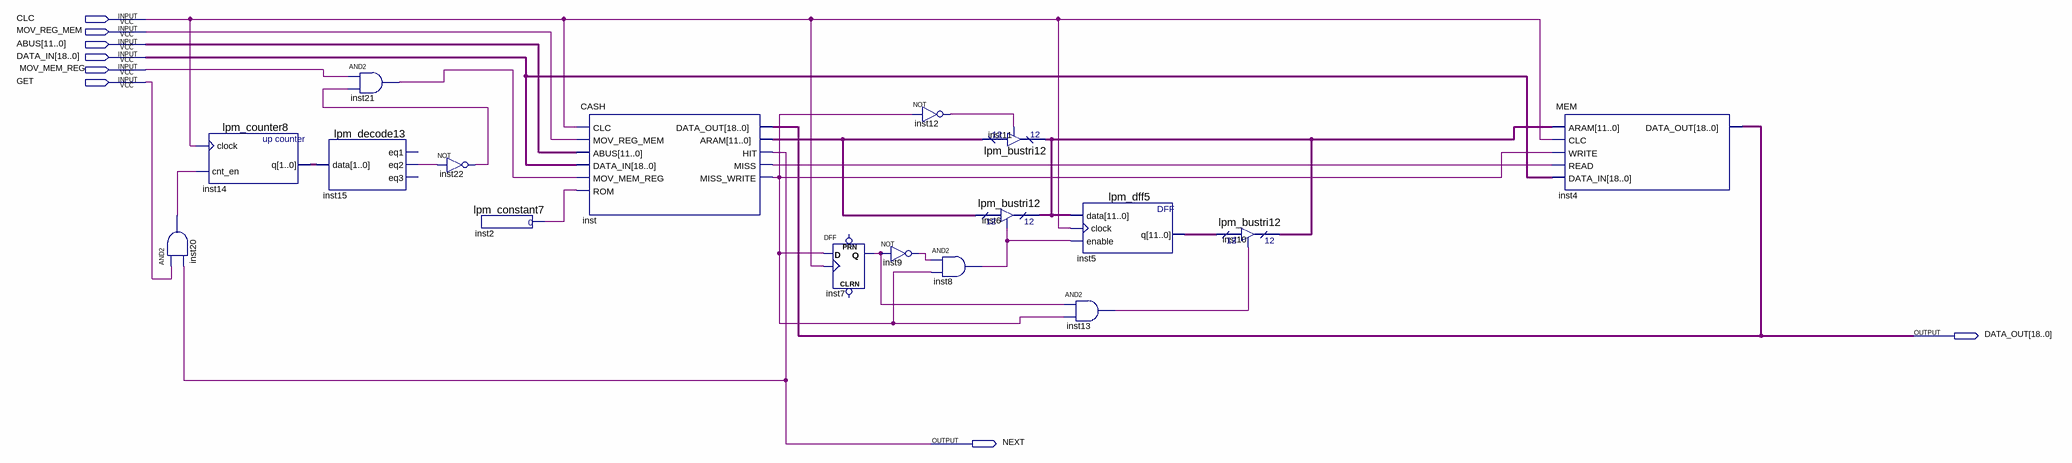
[diagram p0: schematic sheet]
// Quartus schematic MEMORY.bdf as structural Verilog: 17 symbols, 8 pins
module MEMORY (
  input  CLC,
  input  MOV_REG_MEM,
  input  [11:0] ABUS,
  input  [18:0] DATA_IN,
  input  MOV_MEM_REG,
  input  GET,
  output [18:0] DATA_OUT,
  output NEXT
);

  wire inst2_result, inst7_q, inst8_out, inst9_out, inst12_out, inst13_out, inst15_eq2, inst20_out,
       inst21_out, inst22_out, inst_miss, inst_miss_write;
  wire [1:0] inst14_q;
  wire [11:0] inst5_q, inst11_tridata, inst_aram;

  and inst20 (inst20_out, GET, NEXT);
  lpm_counter8 inst14 (.clock(CLC), .cnt_en(inst20_out), .q(inst14_q));
  lpm_decode13 inst15 (.data(inst14_q), .eq2(inst15_eq2));  // open: eq1, eq3
  and inst21 (inst21_out, MOV_MEM_REG, inst22_out);
  not inst22 (inst22_out, inst15_eq2);
  lpm_constant7 inst2 (.result(inst2_result));
  CASH inst (
    .CLC(CLC), .MOV_REG_MEM(MOV_REG_MEM), .ABUS(ABUS), .DATA_IN(DATA_IN), .MOV_MEM_REG(inst21_out),
    .ROM(inst2_result), .DATA_OUT(DATA_OUT), .ARAM(inst_aram), .HIT(NEXT), .MISS(inst_miss),
    .MISS_WRITE(inst_miss_write));
  DFF inst7 (.CLK(CLC), .D(inst_miss_write), .Q(inst7_q));  // open: CLRN, PRN
  not inst9 (inst9_out, inst7_q);
  not inst12 (inst12_out, inst_miss_write);
  and inst8 (inst8_out, inst9_out, inst_miss_write);
  lpm_bustri12 inst11 (.enabledt(inst12_out), .data(inst_aram), .tridata(inst11_tridata));
  lpm_bustri12 inst6 (.enabledt(inst8_out), .data(inst_aram), .tridata(inst11_tridata));
  lpm_dff5 inst5 (.data(inst11_tridata), .clock(CLC), .enable(inst8_out), .q(inst5_q));
  and inst13 (inst13_out, inst7_q, inst_miss_write);
  lpm_bustri12 inst10 (.enabledt(inst13_out), .data(inst5_q), .tridata(inst11_tridata));
  MEM inst4 (
    .ARAM(inst11_tridata), .CLC(CLC), .WRITE(inst_miss_write), .READ(inst_miss), .DATA_IN(DATA_IN),
    .DATA_OUT(DATA_OUT));
endmodule
